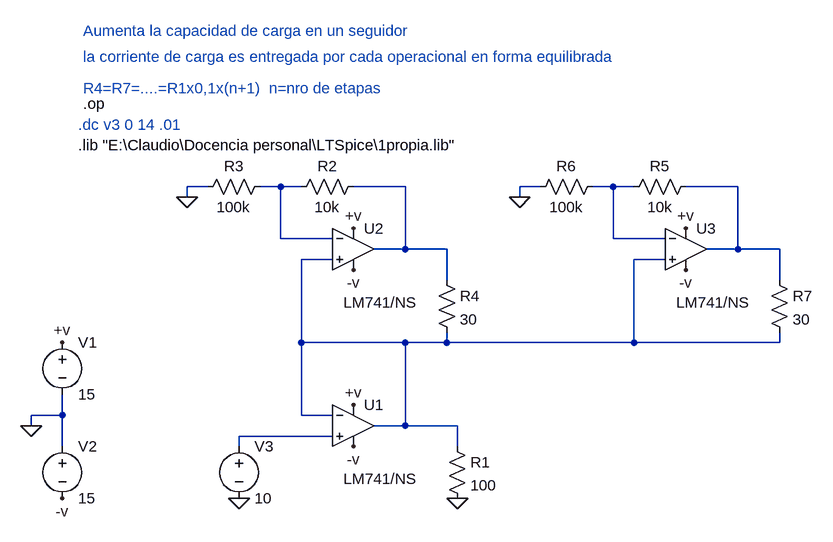
[diagram p0: schematic oper_carga.asc]
oper_carga.asc, the LTspice schematic file:
Version 4
SHEET 1 1064 680
WIRE 32 -96 0 -96
WIRE 144 -96 112 -96
WIRE 176 -96 144 -96
WIRE 336 -96 256 -96
WIRE 544 -96 512 -96
WIRE 656 -96 624 -96
WIRE 688 -96 656 -96
WIRE 848 -96 768 -96
WIRE 0 -80 0 -96
WIRE 512 -80 512 -96
WIRE 144 -16 144 -96
WIRE 224 -16 144 -16
WIRE 656 -16 656 -96
WIRE 736 -16 656 -16
WIRE 336 0 336 -96
WIRE 336 0 288 0
WIRE 400 0 336 0
WIRE 848 0 848 -96
WIRE 848 0 800 0
WIRE 912 0 848 0
WIRE 224 16 176 16
WIRE 736 16 688 16
WIRE 400 48 400 0
WIRE 912 48 912 0
WIRE 176 144 176 16
WIRE 336 144 176 144
WIRE 400 144 400 128
WIRE 400 144 336 144
WIRE 688 144 688 16
WIRE 688 144 400 144
WIRE 912 144 912 128
WIRE 912 144 688 144
WIRE -192 256 -192 224
WIRE -192 256 -240 256
WIRE 176 256 176 144
WIRE 224 256 176 256
WIRE -240 272 -240 256
WIRE 336 272 336 144
WIRE 336 272 288 272
WIRE 416 272 336 272
WIRE 224 288 80 288
WIRE -192 304 -192 256
WIRE 80 304 80 288
WIRE 416 304 416 272
FLAG -240 272 0
FLAG -192 144 +v
FLAG 256 240 +v
FLAG -192 384 -v
FLAG 256 304 -v
FLAG 80 384 0
FLAG 416 384 0
FLAG 256 -32 +v
FLAG 256 32 -v
FLAG 0 -80 0
FLAG 768 -32 +v
FLAG 768 32 -v
FLAG 512 -80 0
DATAFLAG 608 144 ""
DATAFLAG 368 0 ""
DATAFLAG 880 0 ""
DATAFLAG 416 272 ""
SYMBOL OpAmps\\opamp2 256 208 R0
WINDOW 3 -15 146 Left 2
SYMATTR Value LM741/NS
SYMATTR InstName U1
SYMBOL voltage -192 128 R0
WINDOW 123 0 0 Left 0
WINDOW 39 0 0 Left 0
SYMATTR InstName V1
SYMATTR Value 15
SYMBOL voltage -192 288 R0
WINDOW 123 0 0 Left 0
WINDOW 39 0 0 Left 0
SYMATTR InstName V2
SYMATTR Value 15
SYMBOL voltage 80 288 R0
WINDOW 123 0 0 Left 0
WINDOW 39 0 0 Left 0
SYMATTR InstName V3
SYMATTR Value 10
SYMBOL res 400 288 R0
SYMATTR InstName R1
SYMATTR Value 100
SYMBOL OpAmps\\opamp2 256 -64 R0
WINDOW 3 -15 146 Left 2
SYMATTR Value LM741/NS
SYMATTR InstName U2
SYMBOL res 272 -112 R90
WINDOW 0 0 56 VBottom 2
WINDOW 3 32 56 VTop 2
SYMATTR InstName R2
SYMATTR Value 10k
SYMBOL res 128 -112 R90
WINDOW 0 0 56 VBottom 2
WINDOW 3 32 56 VTop 2
SYMATTR InstName R3
SYMATTR Value 100k
SYMBOL res 384 32 R0
SYMATTR InstName R4
SYMATTR Value 30
SYMBOL OpAmps\\opamp2 768 -64 R0
WINDOW 3 -15 146 Left 2
SYMATTR Value LM741/NS
SYMATTR InstName U3
SYMBOL res 784 -112 R90
WINDOW 0 0 56 VBottom 2
WINDOW 3 32 56 VTop 2
SYMATTR InstName R5
SYMATTR Value 10k
SYMBOL res 640 -112 R90
WINDOW 0 0 56 VBottom 2
WINDOW 3 32 56 VTop 2
SYMATTR InstName R6
SYMATTR Value 100k
SYMBOL res 896 32 R0
SYMATTR InstName R7
SYMATTR Value 30
TEXT -168 -160 Left 2 !.lib "E:\\Claudio\\Docencia personal\\LTSpice\\1propia.lib"
TEXT -168 -192 Left 2 ;.dc v3 0 14 .01
TEXT -160 -248 Left 2 ;R4=R7=....=R1x0,1x(n+1)  n=nro de etapas
TEXT -160 -336 Left 2 ;Aumenta la capacidad de carga en un seguidor
TEXT -160 -224 Left 2 !.op
TEXT -160 -296 Left 2 ;la corriente de carga es entregada por cada operacional en forma equilibrada

The netlist it stands for:
* oper_carga.asc
XU1 N006 N005 +v -v N005 LM741/NS  ; pins In+ In- V+ V- OUT
V1 +v 0 15
V2 0 -v 15
V3 N006 0 10
R1 N005 0 100
XU2 N005 N001 +v -v N002 LM741/NS  ; pins In+ In- V+ V- OUT
R2 N002 N001 10k
R3 N001 0 100k
R4 N002 N005 30
XU3 N005 N003 +v -v N004 LM741/NS  ; pins In+ In- V+ V- OUT
R5 N004 N003 10k
R6 N003 0 100k
R7 N004 N005 30
.lib "E:\Claudio\Docencia personal\LTSpice\1propia.lib"
* .dc v3 0 14 .01
* R4=R7=....=R1x0,1x(n+1)  n=nro de etapas
* Aumenta la capacidad de carga en un seguidor
.op
* la corriente de carga es entregada por cada operacional en forma equilibrada
.backanno
.end